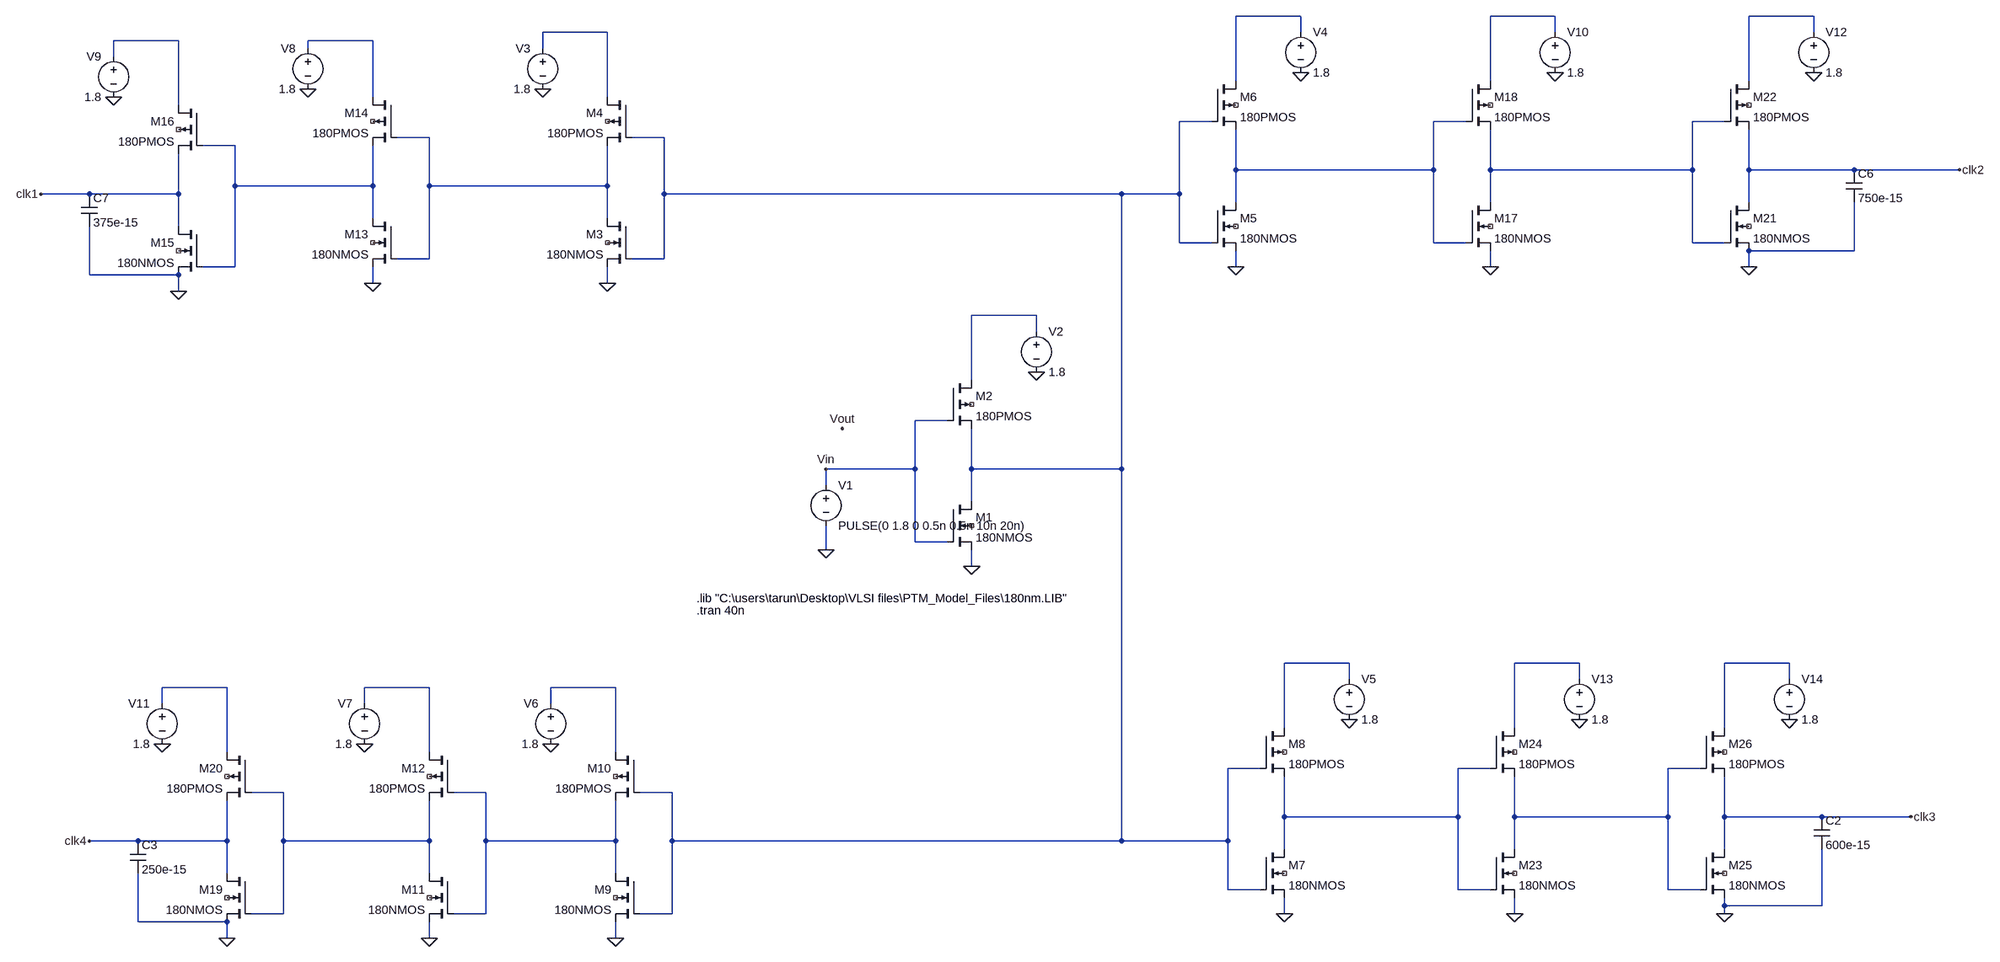
[diagram p0: schematic clock.asc]
clock.asc, the LTspice schematic file:
Version 4
SHEET 1 3152 1236
WIRE 1216 -608 1088 -608
WIRE 1744 -608 1616 -608
WIRE 2320 -608 2192 -608
WIRE -416 -576 -544 -576
WIRE 1216 -576 1216 -608
WIRE 1744 -576 1744 -608
WIRE 2320 -576 2320 -608
WIRE -1264 -560 -1392 -560
WIRE -880 -560 -1008 -560
WIRE -1008 -544 -1008 -560
WIRE -544 -544 -544 -576
WIRE -1392 -528 -1392 -560
WIRE 1088 -480 1088 -608
WIRE 1616 -480 1616 -608
WIRE 2192 -480 2192 -608
WIRE -880 -448 -880 -560
WIRE -416 -448 -416 -576
WIRE -1264 -432 -1264 -560
WIRE 1040 -400 976 -400
WIRE 1568 -400 1504 -400
WIRE 2144 -400 2080 -400
WIRE -768 -368 -832 -368
WIRE -304 -368 -368 -368
WIRE -1152 -352 -1216 -352
WIRE 1088 -304 1088 -384
WIRE 1504 -304 1504 -400
WIRE 1504 -304 1088 -304
WIRE 1616 -304 1616 -384
WIRE 2080 -304 2080 -400
WIRE 2080 -304 1616 -304
WIRE 2192 -304 2192 -384
WIRE 2400 -304 2192 -304
WIRE 2608 -304 2400 -304
WIRE -1152 -272 -1152 -352
WIRE -880 -272 -880 -352
WIRE -880 -272 -1152 -272
WIRE -768 -272 -768 -368
WIRE -416 -272 -416 -352
WIRE -416 -272 -768 -272
WIRE -1440 -256 -1536 -256
WIRE -1264 -256 -1264 -336
WIRE -1264 -256 -1440 -256
WIRE -304 -256 -304 -368
WIRE 624 -256 -304 -256
WIRE 976 -256 976 -400
WIRE 976 -256 624 -256
WIRE 1088 -240 1088 -304
WIRE 1616 -240 1616 -304
WIRE 2192 -240 2192 -304
WIRE -880 -208 -880 -272
WIRE -416 -208 -416 -272
WIRE -1264 -192 -1264 -256
WIRE 976 -160 976 -256
WIRE 1040 -160 976 -160
WIRE 1504 -160 1504 -304
WIRE 1568 -160 1504 -160
WIRE 2080 -160 2080 -304
WIRE 2144 -160 2080 -160
WIRE 2400 -144 2400 -240
WIRE 2400 -144 2192 -144
WIRE -768 -128 -768 -272
WIRE -768 -128 -832 -128
WIRE -304 -128 -304 -256
WIRE -304 -128 -368 -128
WIRE -1152 -112 -1152 -272
WIRE -1152 -112 -1216 -112
WIRE 1088 -112 1088 -144
WIRE 1616 -112 1616 -144
WIRE 2192 -112 2192 -144
WIRE -1440 -96 -1440 -192
WIRE -1264 -96 -1440 -96
WIRE -880 -80 -880 -112
WIRE -416 -80 -416 -112
WIRE -1264 -64 -1264 -96
WIRE 432 -16 304 -16
WIRE 432 16 432 -16
WIRE 304 112 304 -16
WIRE 256 192 192 192
WIRE 192 288 192 192
WIRE 192 288 16 288
WIRE 304 288 304 208
WIRE 624 288 624 -256
WIRE 624 288 304 288
WIRE 16 320 16 288
WIRE 304 352 304 288
WIRE 192 432 192 288
WIRE 256 432 192 432
WIRE 16 448 16 400
WIRE 304 480 304 448
WIRE 1312 672 1184 672
WIRE 1792 672 1664 672
WIRE 2272 672 2144 672
WIRE 1312 704 1312 672
WIRE 1792 704 1792 672
WIRE 2272 704 2272 672
WIRE -1168 720 -1296 720
WIRE -768 720 -896 720
WIRE -400 720 -528 720
WIRE -1296 752 -1296 720
WIRE -896 752 -896 720
WIRE -528 752 -528 720
WIRE 1184 800 1184 672
WIRE 1664 800 1664 672
WIRE 2144 800 2144 672
WIRE -1168 848 -1168 720
WIRE -768 848 -768 720
WIRE -400 848 -400 720
WIRE 1136 880 1072 880
WIRE 1616 880 1552 880
WIRE 2096 880 2032 880
WIRE -1056 928 -1120 928
WIRE -656 928 -720 928
WIRE -288 928 -352 928
WIRE 1184 976 1184 896
WIRE 1552 976 1552 880
WIRE 1552 976 1184 976
WIRE 1664 976 1664 896
WIRE 2032 976 2032 880
WIRE 2032 976 1664 976
WIRE 2144 976 2144 896
WIRE 2336 976 2144 976
WIRE 2512 976 2336 976
WIRE -1344 1024 -1440 1024
WIRE -1168 1024 -1168 944
WIRE -1168 1024 -1344 1024
WIRE -1056 1024 -1056 928
WIRE -768 1024 -768 944
WIRE -768 1024 -1056 1024
WIRE -656 1024 -656 928
WIRE -400 1024 -400 944
WIRE -400 1024 -656 1024
WIRE -288 1024 -288 928
WIRE 624 1024 624 288
WIRE 624 1024 -288 1024
WIRE 1072 1024 1072 880
WIRE 1072 1024 624 1024
WIRE 1184 1040 1184 976
WIRE 1664 1040 1664 976
WIRE 2144 1040 2144 976
WIRE -1168 1088 -1168 1024
WIRE -768 1088 -768 1024
WIRE -400 1088 -400 1024
WIRE 1072 1120 1072 1024
WIRE 1136 1120 1072 1120
WIRE 1552 1120 1552 976
WIRE 1616 1120 1552 1120
WIRE 2032 1120 2032 976
WIRE 2096 1120 2032 1120
WIRE 2144 1152 2144 1136
WIRE 2336 1152 2336 1040
WIRE 2336 1152 2144 1152
WIRE -1056 1168 -1056 1024
WIRE -1056 1168 -1120 1168
WIRE -656 1168 -656 1024
WIRE -656 1168 -720 1168
WIRE -288 1168 -288 1024
WIRE -288 1168 -352 1168
WIRE 1184 1168 1184 1136
WIRE 1664 1168 1664 1136
WIRE 2144 1168 2144 1152
WIRE -1344 1184 -1344 1088
WIRE -1168 1184 -1344 1184
WIRE -1168 1216 -1168 1184
WIRE -768 1216 -768 1184
WIRE -400 1216 -400 1184
FLAG 16 448 0
FLAG 304 480 0
FLAG 432 96 0
FLAG 16 288 Vin
FLAG 48 208 Vout
FLAG -416 -80 0
FLAG -544 -464 0
FLAG 1088 -112 0
FLAG 1216 -496 0
FLAG 1184 1168 0
FLAG 1312 784 0
FLAG -400 1216 0
FLAG -528 832 0
FLAG -880 -80 0
FLAG -1008 -464 0
FLAG -1264 -64 0
FLAG -1392 -448 0
FLAG -1536 -256 clk1
FLAG 1616 -112 0
FLAG 1744 -496 0
FLAG 2192 -112 0
FLAG 2320 -496 0
FLAG 2608 -304 clk2
FLAG 1664 1168 0
FLAG 1792 784 0
FLAG 2144 1168 0
FLAG 2272 784 0
FLAG 2512 976 clk3
FLAG -768 1216 0
FLAG -896 832 0
FLAG -1168 1216 0
FLAG -1296 832 0
FLAG -1440 1024 clk4
SYMBOL voltage 16 304 R0
WINDOW 123 0 0 Left 0
WINDOW 39 0 0 Left 0
SYMATTR InstName V1
SYMATTR Value PULSE(0 1.8 0 0.5n 0.5n 10n 20n)
SYMBOL nmos4 256 352 R0
SYMATTR InstName M1
SYMATTR Value2 l=180nm w=240nm
SYMATTR Value 180NMOS
SYMBOL pmos4 256 112 R0
SYMATTR InstName M2
SYMATTR Value2 l=180nm w=560nm
SYMATTR Value 180PMOS
SYMBOL voltage 432 0 R0
WINDOW 123 0 0 Left 0
WINDOW 39 0 0 Left 0
SYMATTR InstName V2
SYMATTR Value 1.8
SYMBOL nmos4 -368 -208 M0
SYMATTR InstName M3
SYMATTR Value2 l=180nm w=367nm
SYMATTR Value 180NMOS
SYMBOL pmos4 -368 -448 M0
SYMATTR InstName M4
SYMATTR Value2 l=180nm w=856nm
SYMATTR Value 180PMOS
SYMBOL voltage -544 -560 M0
WINDOW 123 0 0 Left 0
WINDOW 39 0 0 Left 0
SYMATTR InstName V3
SYMATTR Value 1.8
SYMBOL nmos4 1040 -240 R0
SYMATTR InstName M5
SYMATTR Value2 l=180nm w=720nm
SYMATTR Value 180NMOS
SYMBOL pmos4 1040 -480 R0
SYMATTR InstName M6
SYMATTR Value2 l=180nm w=1680nm
SYMATTR Value 180PMOS
SYMBOL voltage 1216 -592 R0
WINDOW 123 0 0 Left 0
WINDOW 39 0 0 Left 0
SYMATTR InstName V4
SYMATTR Value 1.8
SYMBOL nmos4 1136 1040 R0
SYMATTR InstName M7
SYMATTR Value2 l=180nm w=552nm
SYMATTR Value 180NMOS
SYMBOL pmos4 1136 800 R0
SYMATTR InstName M8
SYMATTR Value2 l=180nm w=1288nm
SYMATTR Value 180PMOS
SYMBOL voltage 1312 688 R0
WINDOW 123 0 0 Left 0
WINDOW 39 0 0 Left 0
SYMATTR InstName V5
SYMATTR Value 1.8
SYMBOL nmos4 -352 1088 M0
SYMATTR InstName M9
SYMATTR Value2 l=180nm w=240nm
SYMATTR Value 180NMOS
SYMBOL pmos4 -352 848 M0
SYMATTR InstName M10
SYMATTR Value2 l=180nm w=560nm
SYMATTR Value 180PMOS
SYMBOL voltage -528 736 M0
WINDOW 123 0 0 Left 0
WINDOW 39 0 0 Left 0
SYMATTR InstName V6
SYMATTR Value 1.8
SYMBOL nmos4 -832 -208 M0
SYMATTR InstName M13
SYMATTR Value2 l=180nm w=2889nm
SYMATTR Value 180NMOS
SYMBOL pmos4 -832 -448 M0
SYMATTR InstName M14
SYMATTR Value2 l=180nm w=6734nm
SYMATTR Value 180PMOS
SYMBOL voltage -1008 -560 M0
WINDOW 123 0 0 Left 0
WINDOW 39 0 0 Left 0
SYMATTR InstName V8
SYMATTR Value 1.8
SYMBOL nmos4 -1216 -192 M0
SYMATTR InstName M15
SYMATTR Value2 l=180nm w=22743nm
SYMATTR Value 180NMOS
SYMBOL pmos4 -1216 -432 M0
SYMATTR InstName M16
SYMATTR Value2 l=180nm w=53067nm
SYMATTR Value 180PMOS
SYMBOL voltage -1392 -544 M0
WINDOW 123 0 0 Left 0
WINDOW 39 0 0 Left 0
SYMATTR InstName V9
SYMATTR Value 1.8
SYMBOL cap -1456 -256 R0
SYMATTR InstName C7
SYMATTR Value 375e-15
SYMBOL nmos4 1568 -240 R0
SYMATTR InstName M17
SYMATTR Value2 l=180nm w=5666nm
SYMATTR Value 180NMOS
SYMBOL pmos4 1568 -480 R0
SYMATTR InstName M18
SYMATTR Value2 l=180nm w=13221nm
SYMATTR Value 180PMOS
SYMBOL voltage 1744 -592 R0
WINDOW 123 0 0 Left 0
WINDOW 39 0 0 Left 0
SYMATTR InstName V10
SYMATTR Value 1.8
SYMBOL nmos4 2144 -240 R0
SYMATTR InstName M21
SYMATTR Value2 l=180nm w=44594nm
SYMATTR Value 180NMOS
SYMBOL pmos4 2144 -480 R0
SYMATTR InstName M22
SYMATTR Value2 l=180nm w=104053nm
SYMATTR Value 180PMOS
SYMBOL voltage 2320 -592 R0
WINDOW 123 0 0 Left 0
WINDOW 39 0 0 Left 0
SYMATTR InstName V12
SYMATTR Value 1.8
SYMBOL cap 2384 -304 R0
SYMATTR InstName C6
SYMATTR Value 750e-15
SYMBOL nmos4 1616 1040 R0
SYMATTR InstName M23
SYMATTR Value2 l=180nm w=4344nm
SYMATTR Value 180NMOS
SYMBOL pmos4 1616 800 R0
SYMATTR InstName M24
SYMATTR Value2 l=180nm w=10136nm
SYMATTR Value 180PMOS
SYMBOL voltage 1792 688 R0
WINDOW 123 0 0 Left 0
WINDOW 39 0 0 Left 0
SYMATTR InstName V13
SYMATTR Value 1.8
SYMBOL nmos4 2096 1040 R0
SYMATTR InstName M25
SYMATTR Value2 l=180nm w=34889nm
SYMATTR Value 180NMOS
SYMBOL pmos4 2096 800 R0
SYMATTR InstName M26
SYMATTR Value2 l=180nm w=82774nm
SYMATTR Value 180PMOS
SYMBOL voltage 2272 688 R0
WINDOW 123 0 0 Left 0
WINDOW 39 0 0 Left 0
SYMATTR InstName V14
SYMATTR Value 1.8
SYMBOL cap 2320 976 R0
SYMATTR InstName C2
SYMATTR Value 600e-15
SYMBOL nmos4 -720 1088 M0
SYMATTR InstName M11
SYMATTR Value2 l=180nm w=2590nm
SYMATTR Value 180NMOS
SYMBOL pmos4 -720 848 M0
SYMATTR InstName M12
SYMATTR Value2 l=180nm w=4807nm
SYMATTR Value 180PMOS
SYMBOL voltage -896 736 M0
WINDOW 123 0 0 Left 0
WINDOW 39 0 0 Left 0
SYMATTR InstName V7
SYMATTR Value 1.8
SYMBOL nmos4 -1120 1088 M0
SYMATTR InstName M19
SYMATTR Value2 l=180nm w=19864nm
SYMATTR Value 180NMOS
SYMBOL pmos4 -1120 848 M0
SYMATTR InstName M20
SYMATTR Value2 l=180nm w=26684nm
SYMATTR Value 180PMOS
SYMBOL voltage -1296 736 M0
WINDOW 123 0 0 Left 0
WINDOW 39 0 0 Left 0
SYMATTR InstName V11
SYMATTR Value 1.8
SYMBOL cap -1360 1024 R0
SYMATTR InstName C3
SYMATTR Value 250e-15
TEXT -240 544 Left 2 !.lib "C:\\users\\tarun\\Desktop\\VLSI files\\PTM_Model_Files\\180nm.LIB"
TEXT -240 568 Left 2 !.tran 40n

The netlist it stands for:
* clock.asc
V1 Vin 0 PULSE(0 1.8 0 0.5n 0.5n 10n 20n)
M1 N007 Vin 0 NC_01 180NMOS l=180nm w=240nm
M2 N012 Vin N007 NC_02 180PMOS l=180nm w=560nm
V2 N012 0 1.8
M3 N010 N007 0 NC_03 180NMOS l=180nm w=367nm
M4 N004 N007 N010 NC_04 180PMOS l=180nm w=856nm
V3 N004 0 1.8
M5 N008 N007 0 NC_05 180NMOS l=180nm w=720nm
M6 N001 N007 N008 NC_06 180PMOS l=180nm w=1680nm
V4 N001 0 1.8
M7 N019 N007 0 NC_07 180NMOS l=180nm w=552nm
M8 N013 N007 N019 NC_08 180PMOS l=180nm w=1288nm
V5 N013 0 1.8
M9 N022 N007 0 NC_09 180NMOS l=180nm w=240nm
M10 N018 N007 N022 NC_10 180PMOS l=180nm w=560nm
V6 N018 0 1.8
M13 N011 N010 0 NC_11 180NMOS l=180nm w=2889nm
M14 N006 N010 N011 NC_12 180PMOS l=180nm w=6734nm
V8 N006 0 1.8
M15 clk1 N011 0 NC_13 180NMOS l=180nm w=22743nm
M16 N005 N011 clk1 NC_14 180PMOS l=180nm w=53067nm
V9 N005 0 1.8
C7 clk1 0 375e-15
M17 N009 N008 0 NC_15 180NMOS l=180nm w=5666nm
M18 N002 N008 N009 NC_16 180PMOS l=180nm w=13221nm
V10 N002 0 1.8
M21 clk2 N009 0 NC_17 180NMOS l=180nm w=44594nm
M22 N003 N009 clk2 NC_18 180PMOS l=180nm w=104053nm
V12 N003 0 1.8
C6 clk2 0 750e-15
M23 N020 N019 0 NC_19 180NMOS l=180nm w=4344nm
M24 N014 N019 N020 NC_20 180PMOS l=180nm w=10136nm
V13 N014 0 1.8
M25 clk3 N020 0 NC_21 180NMOS l=180nm w=34889nm
M26 N015 N020 clk3 NC_22 180PMOS l=180nm w=82774nm
V14 N015 0 1.8
C2 clk3 0 600e-15
M11 N021 N022 0 NC_23 180NMOS l=180nm w=2590nm
M12 N017 N022 N021 NC_24 180PMOS l=180nm w=4807nm
V7 N017 0 1.8
M19 clk4 N021 0 NC_25 180NMOS l=180nm w=19864nm
M20 N016 N021 clk4 NC_26 180PMOS l=180nm w=26684nm
V11 N016 0 1.8
C3 clk4 0 250e-15
.model NMOS NMOS
.model PMOS PMOS
.lib standard.mos
.lib "C:\users\tarun\Desktop\VLSI files\PTM_Model_Files\180nm.LIB"
.tran 40n
.backanno
.end